# EasyEDA schematic 4.82.json
TITLE: Sheet_1; REV: 1.0; Date: 2020-11-18; Sheet: 1/1; Drawn By: Gökbey Keskin; Company: Your Company
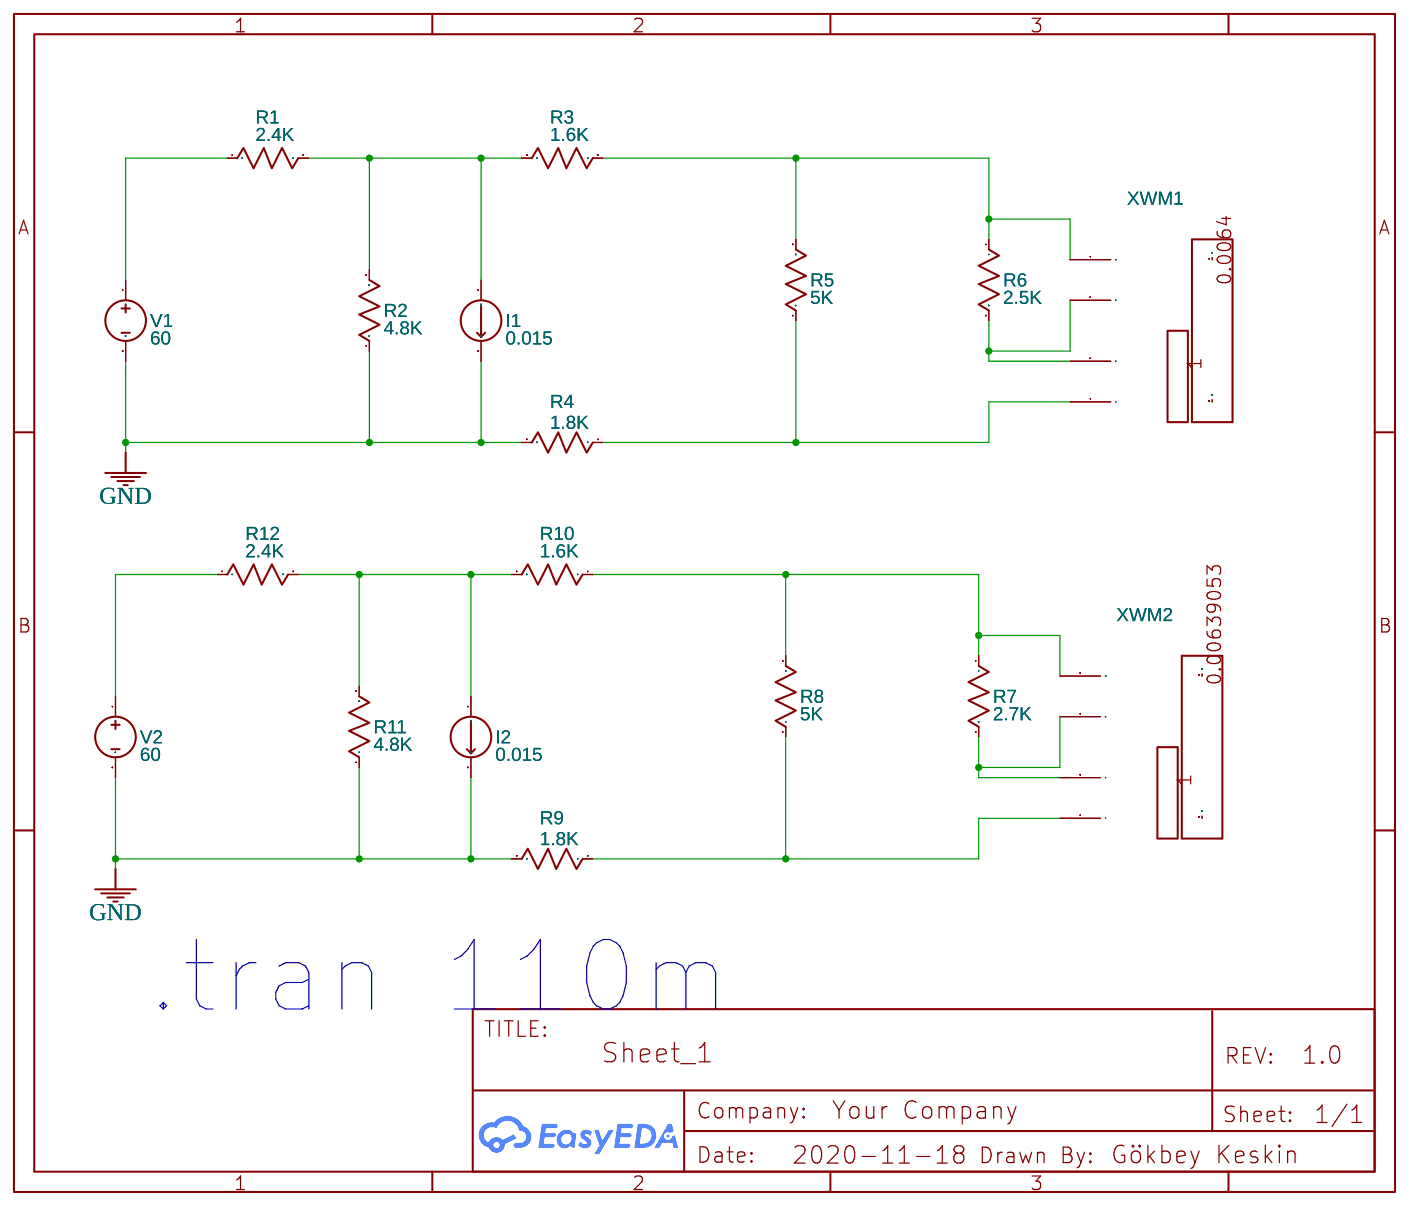
[diagram p0: schematic sheet]

## Parts
I1  0.015  [2P-5.08]
I2  0.015  [2P-5.08]
R1  2.4K  [AXIAL-0.3]
R2  4.8K  [AXIAL-0.3]
R3  1.6K  [AXIAL-0.3]
R4  1.8K  [AXIAL-0.3]
R5  5K  [AXIAL-0.3]
R6  2.5K  [AXIAL-0.3]
R7  2.7K  [AXIAL-0.3]
R8  5K  [AXIAL-0.3]
R9  1.8K  [AXIAL-0.3]
R10  1.6K  [AXIAL-0.3]
R11  4.8K  [AXIAL-0.3]
R12  2.4K  [AXIAL-0.3]
V1  60  [HDR1X2]
V2  60  [HDR1X2]
XWM1  Wattmeter
XWM2  Wattmeter

## Library data of the parts
I1 I2 = IDC: Contributor: EasyEDA; sim: true
R1-R12 = Resistor_US: Resistance: 1k; Contributor: EasyEDA; Supplier: YUJING
V1 V2 = VDC: Contributor: EasyEDA; sim: true
XWM1 XWM2 = WATTMETER: Contributor: EasyEDA; NameDisplay: 0; sim: true

## Nets
GND: I1.2 I2.2 R2.1 R4.2 R9.2 R11.1 V1.2 V2.2
Net-(I1-1): I1.1 R1.2 R2.2 R3.2
Net-(I2-1): I2.1 R10.2 R11.2 R12.2
Net-(R1-1): R1.1 V1.1
Net-(R3-1): R3.1 R5.2 R6.1 XWM1.1(V+)
Net-(R4-1): R4.1 R5.1 XWM1.4(I-)
Net-(R6-2): R6.2 XWM1.2(V-) XWM1.3(I+)
Net-(R7-1): R7.1 R8.2 R10.1 XWM2.1(V+)
Net-(R7-2): R7.2 XWM2.2(V-) XWM2.3(I+)
Net-(R8-1): R8.1 R9.1 XWM2.4(I-)
Net-(R12-1): R12.1 V2.1

Not connected (* = marked no-connect by the designer): XWM1 P PF; XWM2 P PF

## Notes on the sheet
- .tran 110m
